# Altium schematic sheet Sheet1.SchDoc
size A4
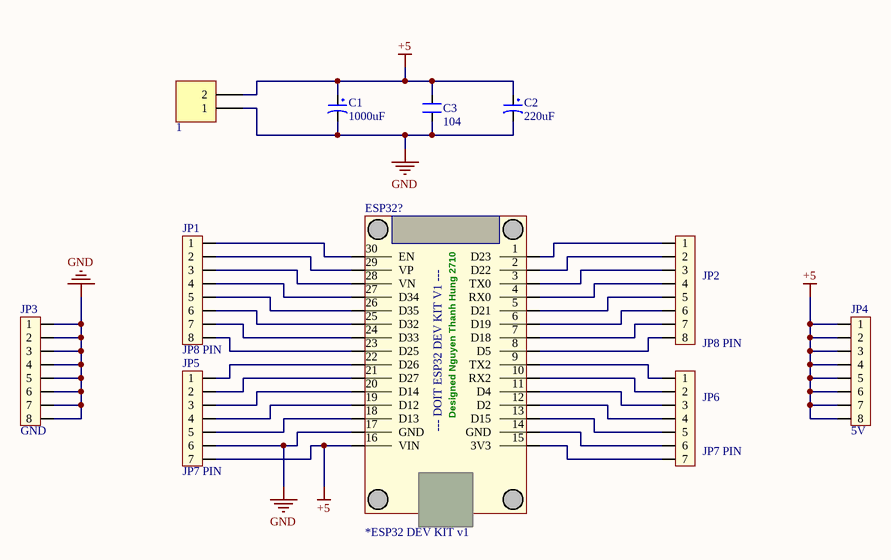
[diagram p0: Sheet1.SchDoc]

## Parts
1  Header 2_1  [HED2]  (value not drawn)
C1  1000uF  [CP1.5/3.4]
C2  220uF  [CP1.5/3.4]
C3  104  [CN1.5]
ESP32?  *ESP32 DEV KIT v1  [DIP30]
JP1  JP8 PIN  [JP8]
JP2  JP8 PIN  [JP8]
JP3  GND  [JP8]
JP4  5V  [JP8]
JP5  JP7 PIN  [JP7]
JP6  JP7 PIN  [JP7]

## Nets
+5: 1.2 C1.1 C2.1 C3.2 ESP32?.16(VIN) JP4.1 JP4.2 JP4.3 JP4.4 JP4.5 JP4.6 JP4.7 JP4.8 JP5.7
GND: 1.1 C1.2 C2.2 C3.1 ESP32?.17(GND) JP3.1 JP3.2 JP3.3 JP3.4 JP3.5 JP3.6 JP3.7 JP3.8 JP5.6
NetESP32?_1: ESP32?.1(D23) JP2.1
NetESP32?_2: ESP32?.2(D22) JP2.2
NetESP32?_3: ESP32?.3(TX0) JP2.3
NetESP32?_4: ESP32?.4(RX0) JP2.4
NetESP32?_5: ESP32?.5(D21) JP2.5
NetESP32?_6: ESP32?.6(D19) JP2.6
NetESP32?_7: ESP32?.7(D18) JP2.7
NetESP32?_8: ESP32?.8(D5) JP2.8
NetESP32?_9: ESP32?.9(TX2) JP6.1
NetESP32?_10: ESP32?.10(RX2) JP6.2
NetESP32?_11: ESP32?.11(D4) JP6.3
NetESP32?_12: ESP32?.12(D2) JP6.4
NetESP32?_13: ESP32?.13(D15) JP6.5
NetESP32?_14: ESP32?.14(GND) JP6.6
NetESP32?_15: ESP32?.15(3V3) JP6.7
NetESP32?_18: ESP32?.18(D13) JP5.5
NetESP32?_19: ESP32?.19(D12) JP5.4
NetESP32?_20: ESP32?.20(D14) JP5.3
NetESP32?_21: ESP32?.21(D27) JP5.2
NetESP32?_22: ESP32?.22(D26) JP5.1
NetESP32?_23: ESP32?.23(D25) JP1.8
NetESP32?_24: ESP32?.24(D33) JP1.7
NetESP32?_25: ESP32?.25(D32) JP1.6
NetESP32?_26: ESP32?.26(D35) JP1.5
NetESP32?_27: ESP32?.27(D34) JP1.4
NetESP32?_28: ESP32?.28(VN) JP1.3
NetESP32?_29: ESP32?.29(VP) JP1.2
NetESP32?_30: ESP32?.30(EN) JP1.1

## Notes on the sheet
- (in symbol ESP32v1) Designed Nguyen Thanh Hung 2710; --- DOIT ESP32 DEV KIT V1 ---

## Library data of the parts
1 = Header 2_1: Header, 2-Pin; Manufacturer: Generic Components; Class: Connector; Value: Header 2
C1 = CP4: Cap 1000uF/16V - 220uF/50V; Description 5: 4,7uF>10uF/250V_3,3uF>10uF/400V - 2,2uF>4,7uF/450V; Description 1: 2200uF-3300uF/6,3V - 1000uF-2200uF/10V; Description 2: 1000uF/16V - 470uF => 1000uF/25V - 100uF/100V; Description 3: 330uF>470uF/35V_220uF>470uF/50V_10uF>22uF/250V; Description 4: 220uF => 330uF/63V - 10uF =>33uF/160 - 200V; Value: 1000uF/16V
C2 = CP4: Description 5: 4,7uF>10uF/250V_3,3uF>10uF/400V - 2,2uF>4,7uF/450V; Description 1: 2200uF-3300uF/6,3V - 1000uF-2200uF/10V; Description 2: 1000uF/16V - 470uF => 1000uF/25V - 100uF/100V; Description 3: 330uF>470uF/35V_220uF>470uF/50V_10uF>22uF/250V; Description 4: 220uF => 330uF/63V - 10uF =>33uF/160 - 200V; Value: 1000uF/16V
C3 = CN1.5: Cap np 682pF => 104pF; Value: 0.01uF
ESP32? = ESP32v1
JP1 JP2 = JP8: Value: JP7
JP3 JP4 = JP8: JP8 PIN; Value: JP7
JP5 JP6 = JP7: Value: JP7